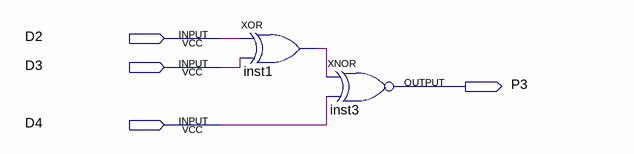
[diagram p0: schematic sheet]
// Quartus schematic generate_p3.bdf as structural Verilog: 2 symbols, 4 pins
module generate_p3 (
  input  D2,
  input  D3,
  input  D4,
  output P3
);

  wire inst1_out;

  xor inst1 (inst1_out, D2, D3);
  xnor inst3 (P3, inst1_out, D4);
endmodule
